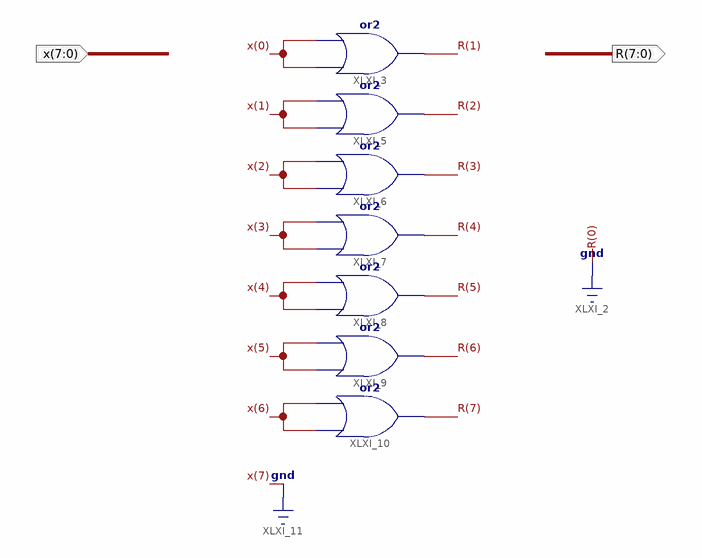
[diagram p0: schematic sheet 1]
// Xilinx ISE schematic shl_8bits.sch (spartan6) as structural Verilog: 7 symbols, 2 ports
module shl_8bits (
  input  [7:0] x,
  output [7:0] R
);

  or XLXI_3 (R[1], x[0], x[0]);
  or XLXI_5 (R[2], x[1], x[1]);
  or XLXI_6 (R[3], x[2], x[2]);
  or XLXI_7 (R[4], x[3], x[3]);
  or XLXI_8 (R[5], x[4], x[4]);
  or XLXI_9 (R[6], x[5], x[5]);
  or XLXI_10 (R[7], x[6], x[6]);

  assign R[0] = 1'b0;
  // also tied to GND on the sheet: x[7]
endmodule
